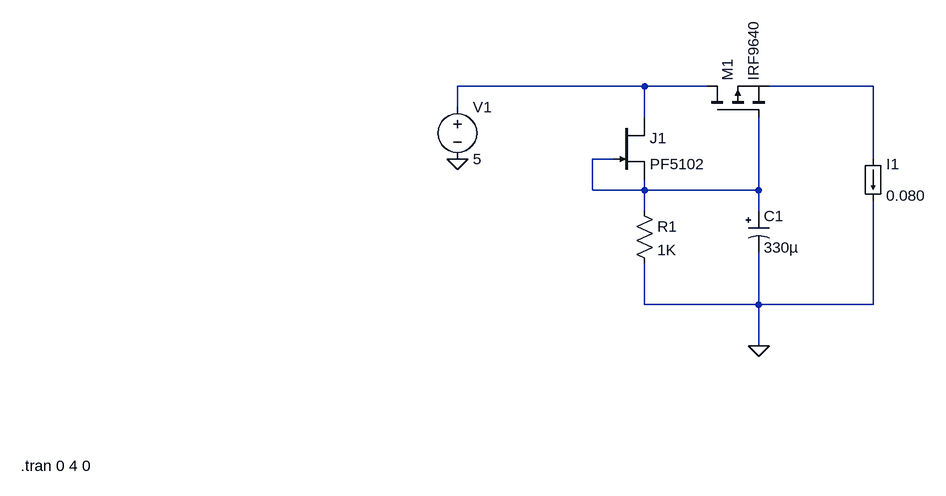
[diagram p0: schematic Draft2.asc]
Draft2.asc, the LTspice schematic file:
Version 4
SHEET 1 1160 680
WIRE 704 -128 416 -128
WIRE 800 -128 704 -128
WIRE 1056 -128 896 -128
WIRE 416 -96 416 -128
WIRE 704 -80 704 -128
WIRE 656 -16 624 -16
WIRE 1056 -16 1056 -128
WIRE 624 32 624 -16
WIRE 704 32 704 16
WIRE 704 32 624 32
WIRE 880 32 880 -80
WIRE 880 32 704 32
WIRE 704 64 704 32
WIRE 880 64 880 32
WIRE 704 208 704 144
WIRE 880 208 880 128
WIRE 880 208 704 208
WIRE 1056 208 1056 48
WIRE 1056 208 880 208
WIRE 880 272 880 208
FLAG 416 -16 0
FLAG 880 272 0
SYMBOL voltage 416 -112 R0
WINDOW 123 0 0 Left 2
WINDOW 39 0 0 Left 2
SYMATTR InstName V1
SYMATTR Value 5
SYMBOL njf 656 -80 R0
SYMATTR InstName J1
SYMATTR Value PF5102
SYMBOL res 688 48 R0
SYMATTR InstName R1
SYMATTR Value 1K
SYMBOL pmos 800 -80 R270
SYMATTR InstName M1
SYMATTR Value IRF9640
SYMBOL polcap 864 64 R0
WINDOW 3 24 56 Left 2
SYMATTR InstName C1
SYMATTR Value 330µ
SYMATTR Description Capacitor
SYMATTR Type cap
SYMATTR SpiceLine V=16 Irms=600m Rser=0.13 Lser=0 mfg="Nichicon" pn="UPH1C331MRH" type="Al electrolytic"
SYMBOL load 1040 -16 R0
WINDOW 123 0 0 Left 2
WINDOW 39 0 0 Left 2
SYMATTR InstName I1
SYMATTR Value 0.080
TEXT -256 456 Left 2 !.tran 0 4 0

The netlist it stands for:
* Draft2.asc
V1 N001 0 5
J1 N001 N003 N003 PF5102
R1 N003 0 1K
M1 N001 N003 N002 N002 IRF9640
C1 N003 0 330µ V=16 Irms=600m Rser=0.13 Lser=0 mfg="Nichicon" pn="UPH1C331MRH" type="Al electrolytic"
I1 N002 0 0.080
.model NJF NJF
.model PJF PJF
.lib standard.jft
.model NMOS NMOS
.model PMOS PMOS
.lib standard.mos
.tran 0 4 0
.backanno
.end